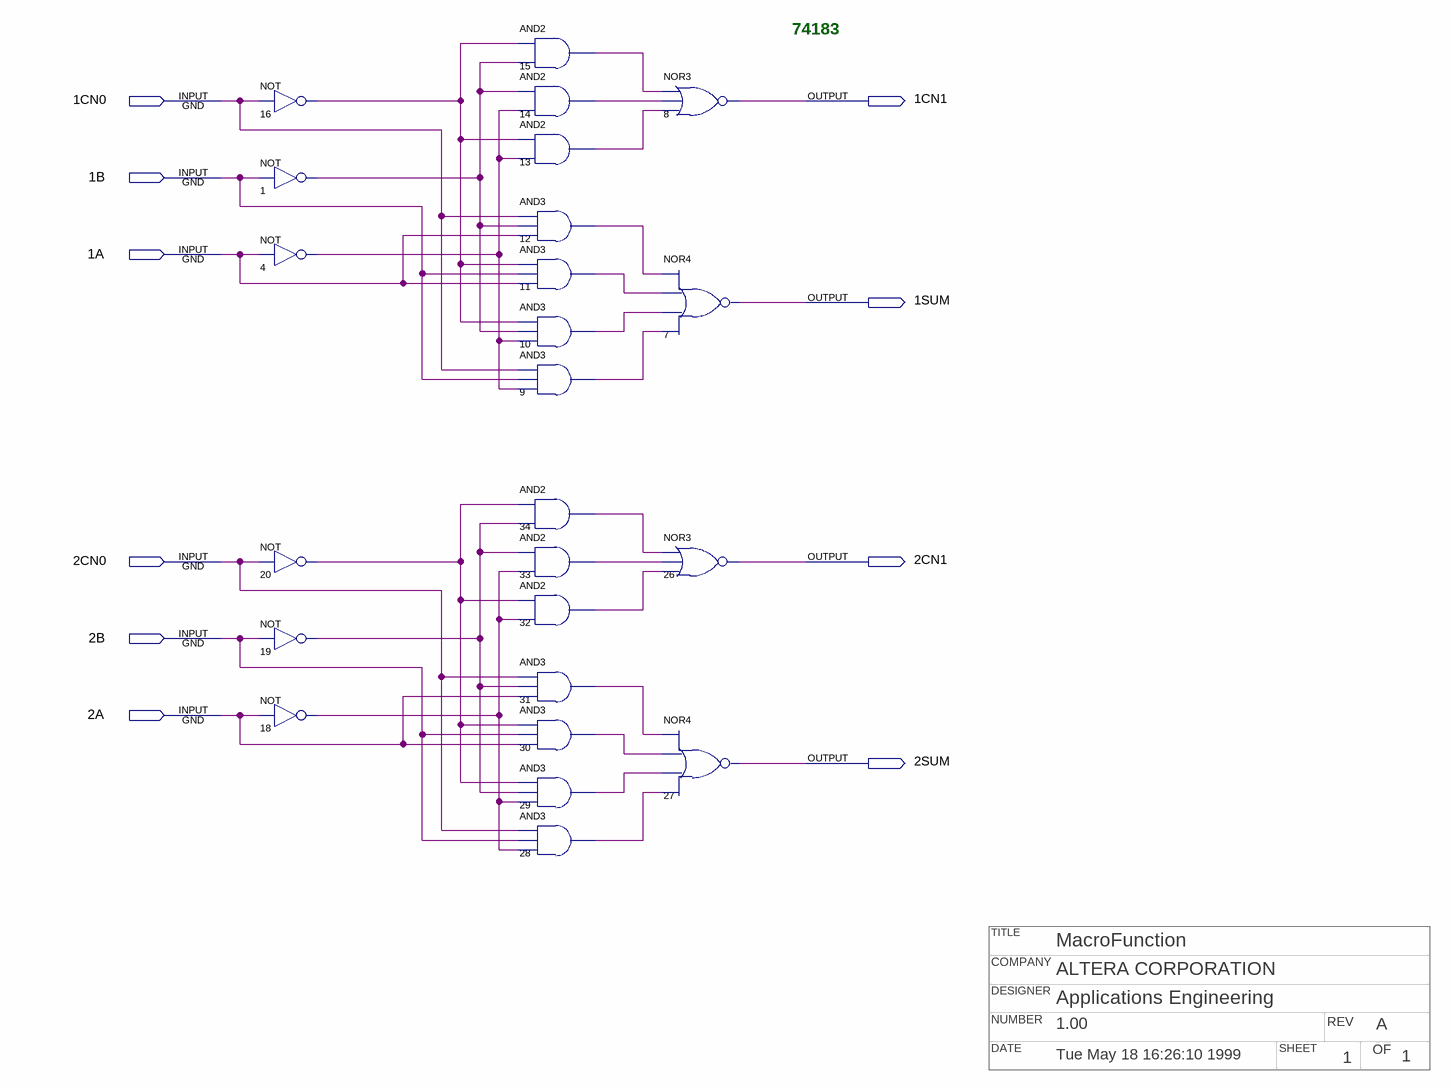
[diagram p0: schematic sheet]
// Quartus schematic 74183.bdf as structural Verilog: 24 symbols, 10 pins
// Title block: TITLE: MacroFunction; COMPANY: ALTERA CORPORATION; DESIGNER: Applications Engineering; NUMBER: 1.00; REV: A; DATE: Tue May 18 16:26:10 1999; SHEET: 1; OF: 1
module \74183  (
  input  \1CN0 ,
  input  \1B ,
  input  \1A ,
  input  \2CN0 ,
  input  \2B ,
  input  \2A ,
  output \1CN1 ,
  output \1SUM ,
  output \2CN1 ,
  output \2SUM 
);

  wire n1_out, n4_out, n9_out, n10_out, n11_out, n12_out, n13_out, n14_out, n15_out, n16_out, n18_out,
       n19_out, n20_out, n28_out, n29_out, n30_out, n31_out, n32_out, n33_out, n34_out;

  not u_16 (n16_out, \1CN0 );
  not u_1 (n1_out, \1B );
  not u_4 (n4_out, \1A );
  not u_20 (n20_out, \2CN0 );
  not u_19 (n19_out, \2B );
  not u_18 (n18_out, \2A );
  and u_15 (n15_out, n16_out, n1_out);
  and u_14 (n14_out, n1_out, n4_out);
  and u_13 (n13_out, n16_out, n4_out);
  and u_12 (n12_out, \1CN0 , n1_out, \1A );
  and u_11 (n11_out, n16_out, \1B , \1A );
  and u_10 (n10_out, n16_out, n1_out, n4_out);
  and u_9 (n9_out, \1CN0 , \1B , n4_out);
  and u_34 (n34_out, n20_out, n19_out);
  and u_33 (n33_out, n19_out, n18_out);
  and u_32 (n32_out, n20_out, n18_out);
  and u_31 (n31_out, \2CN0 , n19_out, \2A );
  and u_30 (n30_out, n20_out, \2B , \2A );
  and u_29 (n29_out, n20_out, n19_out, n18_out);
  and u_28 (n28_out, \2CN0 , \2B , n18_out);
  nor u_8 (\1CN1 , n15_out, n14_out, n13_out);
  nor u_7 (\1SUM , n12_out, n11_out, n10_out, n9_out);
  nor u_26 (\2CN1 , n34_out, n33_out, n32_out);
  nor u_27 (\2SUM , n31_out, n30_out, n29_out, n28_out);

  // Notes on the sheet:
  //   74183
endmodule
